# Altium schematic sheet Shift_register_Expansion.SchDoc: RP2040 CNC
size B; Author: AM; CompanyName: Expatria Technologies; DrawnBy: A.Marles; Engineer: AM; Organization: Expatria Technolgoies; DocumentNumber: 7; SheetNumber: 7; SheetTotal: 14
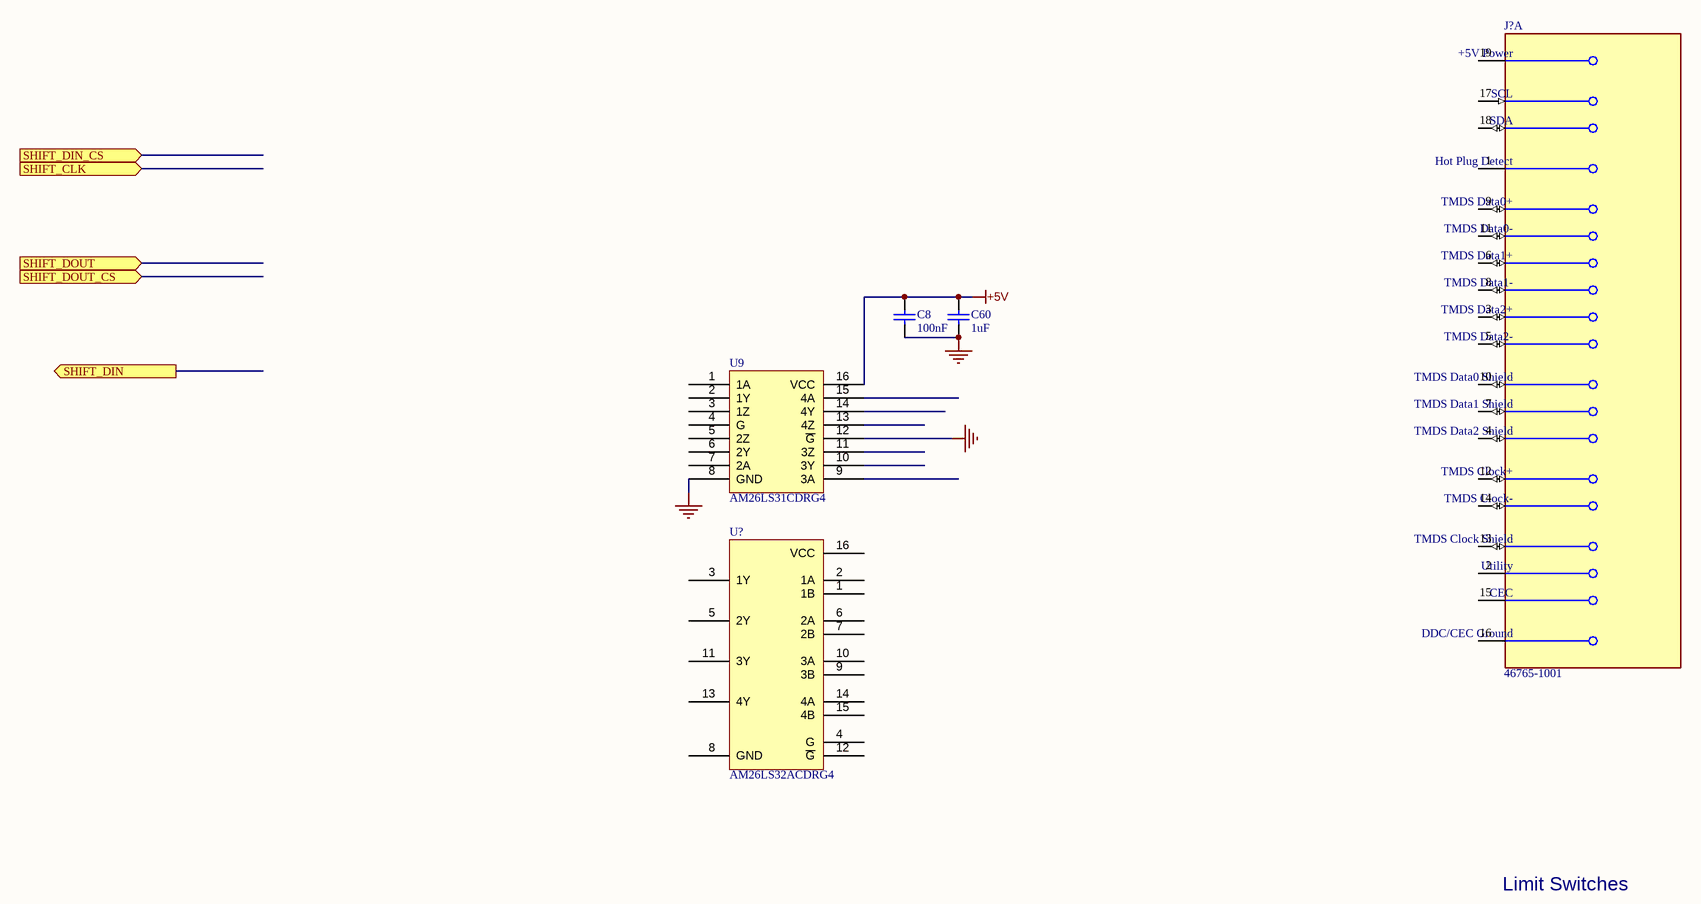
[diagram p0: Shift_register_Expansion.SchDoc]

## Parts
C8  100nF  [0603_C]
C60  1uF  [0603_C]
J?  46765-1001  [FP-46765-1001-MFG]  (part A of 2)
U9  AM26LS31CDRG4  [SOIC-16_150mil]
U?  AM26LS32ACDRG4  [SOIC-16_150mil]

## Ports
SHIFT_CLK (in), SHIFT_DIN (out), SHIFT_DIN_CS (in), SHIFT_DOUT (in), SHIFT_DOUT_CS (in)

## Nets
+5V: C8.1 C60.1 U9.16(VCC)
GND: C8.2 C60.2 U9.8(GND) U9.12(~{G})

Not connected (* = marked no-connect by the designer): J? 1(Hot_Plug_Detect) 2(Utility) 3(TMDS_Data2+) 4(TMDS_Data2_Shield) 5(TMDS_Data2-) 6(TMDS_Data1+) 7(TMDS_Data1_Shield) 8(TMDS_Data1-) 9(TMDS_Data0+) 10(TMDS_Data0_Shield) 11(TMDS_Data0-) 12(TMDS_Clock+) 13(TMDS_Clock_Shield) 14(TMDS_Clock-) 15(CEC) 16(DDC/CEC_Ground) 17(SCL) 18(SDA) 19(+5V_Power); U9 1(1A) 2(1Y) 3(1Z) 4(G) 5(2Z) 6(2Y) 7(2A) 9(3A) 10(3Y) 11(3Z) 13(4Z) 14(4Y) 15(4A); U? 1(1B) 2(1A) 3(1Y) 4(G) 5(2Y) 6(2A) 7(2B) 8(GND) 9(3B) 10(3A) 11(3Y) 12(~{G}) 13(4Y) 14(4A) 15(4B) 16(VCC)

## Notes on the sheet
- Limit Switches
- SHEET
- Expatria Technologies
- 1136 Glade Court
- Port Coquitlam, BC V3B 1R5
- PROJECT
- SIZE
- ENGR
- MODIFIED
- DOCUMENT
- REV
- Copyright Expatria Technologies 2022. This document describes Open Hardware and is licensed under the CERN-OHL-S v2. No warranty is implied or expressed.
- EMAIL: INFO@EXPATRIA.CA
- B
- /

## Library data of the parts
C8 = 0603 100nF (104) 10% 50V: Chip capacitors; Manufacturer: YAGEO; PartNumber: CC0603KRX7R9BB104; Tolerance: 10%; Voltage: 50V; ComponentLink1Description: Supplier link; ComponentLink1URL: http://www.szlcsc.com/product/details_15331.html; Package: 0603; Supplier: LC; SuppliersPartNumber: C14663; Capacitance: 100nF
C60 = 0603 1uF (105) 10% 50V: Chip capacitors; Manufacturer: Samsung Electro-Mechanics; PartNumber: CL10A105KB8NNNC; Tolerance: 10%; Voltage: 50V; ComponentLink1Description: Supplier link; ComponentLink1URL: http://www.szlcsc.com/product/details_16531.html; Package: 0603; Supplier: LC; SuppliersPartNumber: C15849; Capacitance: 1uF
J? = CMP-04768-000007-1: CONN RCP MICRO HDMI 19POS SMD RA; Voltage Rating: 30V; Pitch: 0.4mm; Number of Terminals/Pins: 19; Number of Ports: 1; Current Rating: 800mA; Gender: Receptacle; Body Material: Plastic; Min Operating Temperature: -30°C; Series: 46765; Contact Material: Copper Alloy; Contact Plating: Gold; Connector Type: HDMI; Mount: Surface Mount; Termination: Solder; Package Quantity: 1000; Flammability Rating: UL94 V-0; Packaging: Tape and Reel; Length: 6.5mm; Number of Positions: 19; Number of Contacts: 19; Weight: 0.0109oz; Max Current Rating: 800mA; Case/Package: Metal; Housing Material: Polymer; RoHS Compliant: Yes; Max Operating Temperature: 85°C; Orientation: Right Angle; Depth: 7.5mm; Width: 7mm
U9 = AM26LS31CDRG4_[C6179]: 4/0 Driver - RS422, RS485 16-SOIC; Manufacturer 1: Texas Instruments; ComponentLink1Description: 供应商链接; ComponentLink1URL: http://www.szlcsc.com/product/details_6645.html; Package: SOIC-16_150mil; Supplier: LC; SuppliersPartNumber: C6179; Manufacturer Part Number 1: AM26LS31CDR
U? = AM26LS32ACDRG4_[C6180]: RS-422 Interface IC Quad Diff Line Rcvr; ComponentLink1Description: 供应商链接; ComponentLink1URL: http://www.szlcsc.com/product/details_6646.html; Package: SOIC-16_150mil; Supplier: LC; SuppliersPartNumber: C6180